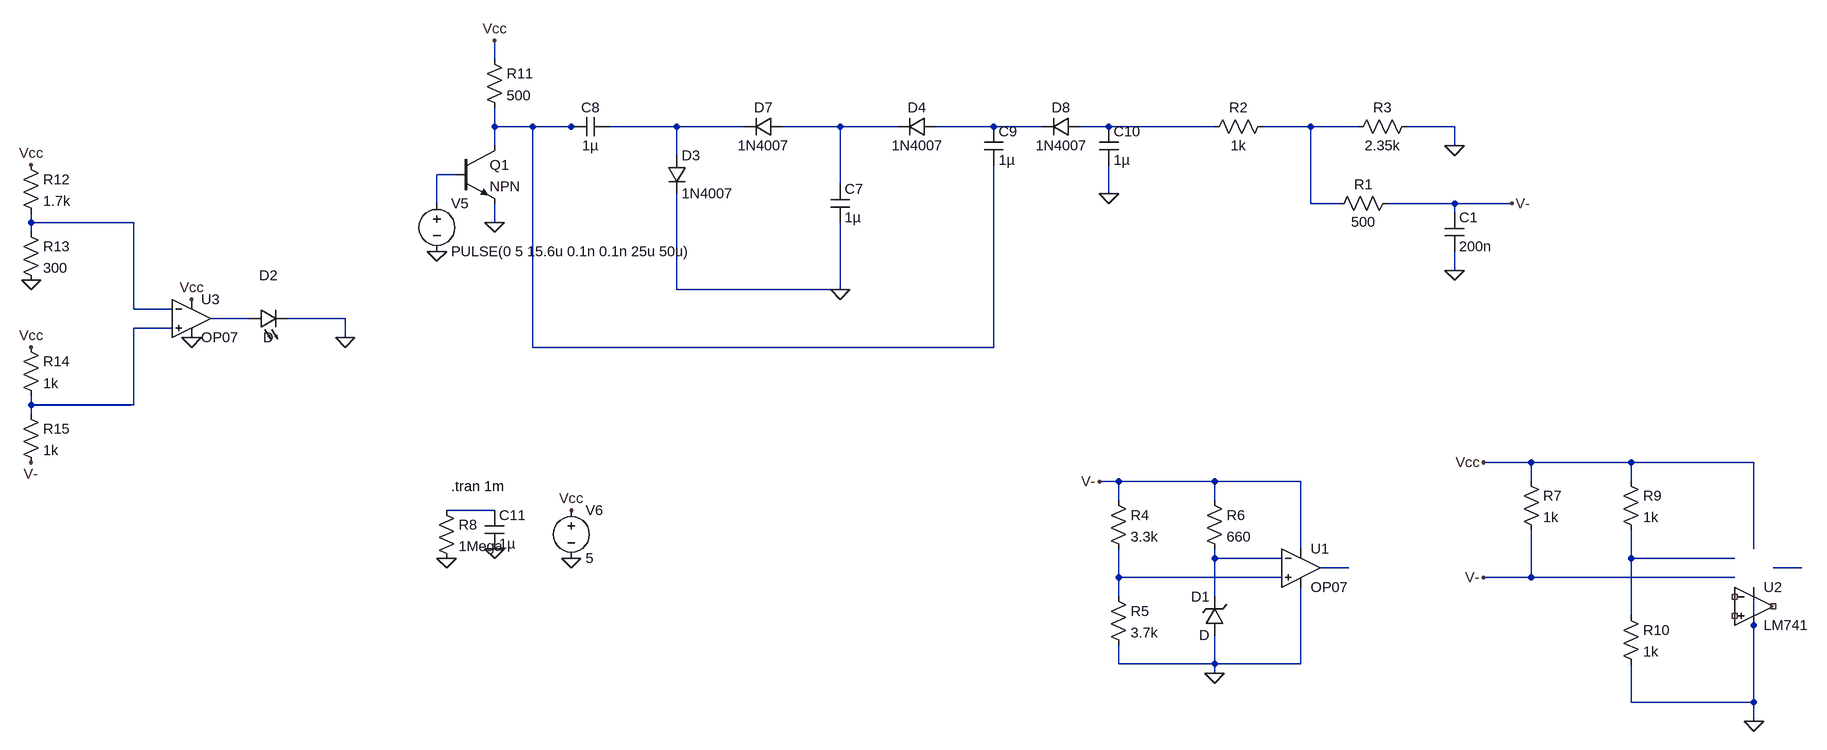
[diagram p0: schematic Lab_project.asc]
Lab_project.asc, the LTspice schematic file:
Version 4
SHEET 1 4400 1044
WIRE 2160 -80 2160 -112
WIRE 2160 32 2160 0
WIRE 2224 32 2160 32
WIRE 2288 32 2224 32
WIRE 2304 32 2288 32
WIRE 2464 32 2352 32
WIRE 2576 32 2464 32
WIRE 2736 32 2640 32
WIRE 2832 32 2736 32
WIRE 2992 32 2896 32
WIRE 3072 32 2992 32
WIRE 3184 32 3136 32
WIRE 3360 32 3184 32
WIRE 3520 32 3440 32
WIRE 3600 32 3520 32
WIRE 3760 32 3680 32
WIRE 2160 64 2160 32
WIRE 3760 64 3760 32
WIRE 2464 80 2464 32
WIRE 2096 112 2064 112
WIRE 2736 128 2736 32
WIRE 3184 144 3184 96
WIRE 2064 160 2064 112
WIRE 3520 160 3520 32
WIRE 3568 160 3520 160
WIRE 3760 160 3648 160
WIRE 3856 160 3760 160
WIRE 3760 176 3760 160
WIRE 336 192 336 176
WIRE 544 192 336 192
WIRE 2160 192 2160 160
WIRE 336 208 336 192
WIRE 3760 272 3760 240
WIRE 2464 304 2464 144
WIRE 2736 304 2736 192
WIRE 2736 304 2464 304
WIRE 544 336 544 192
WIRE 608 336 544 336
WIRE 736 352 672 352
WIRE 896 352 800 352
WIRE 608 368 544 368
WIRE 896 384 896 352
WIRE 2224 400 2224 32
WIRE 2992 400 2992 96
WIRE 2992 400 2224 400
WIRE 336 496 336 480
WIRE 544 496 544 368
WIRE 544 496 336 496
WIRE 336 512 336 496
WIRE 3888 592 3808 592
WIRE 4096 592 3888 592
WIRE 4304 592 4096 592
WIRE 3200 624 3168 624
WIRE 3360 624 3200 624
WIRE 3504 624 3360 624
WIRE 3888 624 3888 592
WIRE 4096 624 4096 592
WIRE 3200 656 3200 624
WIRE 3360 656 3360 624
WIRE 2160 672 2080 672
WIRE 3504 736 3504 624
WIRE 4304 736 4304 592
WIRE 3360 752 3360 736
WIRE 3472 752 3360 752
WIRE 4096 752 4096 704
WIRE 4272 752 4096 752
WIRE 3584 768 3536 768
WIRE 4384 768 4336 768
WIRE 3200 784 3200 736
WIRE 3472 784 3200 784
WIRE 3888 784 3888 704
WIRE 3888 784 3808 784
WIRE 4272 784 3888 784
WIRE 3200 816 3200 784
WIRE 3360 816 3360 752
WIRE 4096 848 4096 752
WIRE 3200 928 3200 896
WIRE 3360 928 3360 880
WIRE 3360 928 3200 928
WIRE 3504 928 3504 800
WIRE 3504 928 3360 928
WIRE 3360 944 3360 928
WIRE 4096 992 4096 928
WIRE 4304 992 4304 800
WIRE 4304 992 4096 992
WIRE 4304 1024 4304 992
FLAG 2064 240 0
FLAG 2736 304 0
FLAG 3184 144 0
FLAG 2160 736 0
FLAG 2080 752 0
FLAG 3760 272 0
FLAG 3760 64 0
FLAG 3856 160 V-
FLAG 3360 944 0
FLAG 3168 624 V-
FLAG 4304 1024 0
FLAG 3808 784 V-
FLAG 2288 752 0
FLAG 2288 672 Vcc
FLAG 3808 592 Vcc
FLAG 2160 192 0
FLAG 2160 -112 Vcc
FLAG 640 320 Vcc
FLAG 640 384 0
FLAG 336 288 0
FLAG 336 96 Vcc
FLAG 336 400 Vcc
FLAG 336 592 V-
FLAG 896 384 0
SYMBOL voltage 2064 144 R0
WINDOW 123 0 0 Left 0
WINDOW 39 0 0 Left 0
SYMATTR InstName V5
SYMATTR Value PULSE(0 5 15.6u 0.1n 0.1n 25u 50u)
SYMBOL cap 2720 128 R0
SYMATTR InstName C7
SYMATTR Value 1µ
SYMBOL cap 2288 48 R270
WINDOW 0 32 32 VTop 2
WINDOW 3 0 32 VBottom 2
SYMATTR InstName C8
SYMATTR Value 1µ
SYMBOL diode 2448 80 R0
SYMATTR InstName D3
SYMATTR Value 1N4007
SYMBOL diode 2640 16 R90
WINDOW 0 0 32 VBottom 2
WINDOW 3 32 32 VTop 2
SYMATTR InstName D7
SYMATTR Value 1N4007
SYMBOL diode 2896 16 R90
WINDOW 0 0 32 VBottom 2
WINDOW 3 32 32 VTop 2
SYMATTR InstName D4
SYMATTR Value 1N4007
SYMBOL cap 2976 32 R0
SYMATTR InstName C9
SYMATTR Value 1µ
SYMBOL voltage 2288 656 R0
WINDOW 123 0 0 Left 0
WINDOW 39 0 0 Left 0
SYMATTR InstName V6
SYMATTR Value 5
SYMBOL diode 3136 16 R90
WINDOW 0 0 32 VBottom 2
WINDOW 3 32 32 VTop 2
SYMATTR InstName D8
SYMATTR Value 1N4007
SYMBOL cap 3168 32 R0
SYMATTR InstName C10
SYMATTR Value 1µ
SYMBOL cap 2144 672 R0
SYMATTR InstName C11
SYMATTR Value 1µ
SYMBOL res 2064 656 R0
SYMATTR InstName R8
SYMATTR Value 1Mega
SYMBOL res 3664 144 R90
WINDOW 0 0 56 VBottom 2
WINDOW 3 32 56 VTop 2
SYMATTR InstName R1
SYMATTR Value 500
SYMBOL cap 3744 176 R0
SYMATTR InstName C1
SYMATTR Value 200n
SYMBOL res 3456 16 R90
WINDOW 0 0 56 VBottom 2
WINDOW 3 32 56 VTop 2
SYMATTR InstName R2
SYMATTR Value 1k
SYMBOL res 3696 16 R90
WINDOW 0 0 56 VBottom 2
WINDOW 3 32 56 VTop 2
SYMATTR InstName R3
SYMATTR Value 2.35k
SYMBOL res 3184 640 R0
SYMATTR InstName R4
SYMATTR Value 3.3k
SYMBOL res 3184 800 R0
SYMATTR InstName R5
SYMATTR Value 3.7k
SYMBOL res 3344 640 R0
SYMATTR InstName R6
SYMATTR Value 660
SYMBOL zener 3376 880 R180
WINDOW 0 24 64 Left 2
WINDOW 3 24 0 Left 2
SYMATTR InstName D1
SYMBOL OpAmps\\OP07 3504 704 R0
SYMATTR InstName U1
SYMBOL npn 2096 64 R0
SYMATTR InstName Q1
SYMBOL res 3872 608 R0
SYMATTR InstName R7
SYMATTR Value 1k
SYMBOL res 4080 608 R0
SYMATTR InstName R9
SYMATTR Value 1k
SYMBOL res 4080 832 R0
SYMATTR InstName R10
SYMATTR Value 1k
SYMBOL OpAmps\\LM741 4304 768 R0
SYMATTR InstName U2
SYMBOL res 2144 -96 R0
SYMATTR InstName R11
SYMATTR Value 500
SYMBOL OpAmps\\OP07 640 288 R0
SYMATTR InstName U3
SYMBOL res 320 80 R0
SYMATTR InstName R12
SYMATTR Value 1.7k
SYMBOL res 320 192 R0
SYMATTR InstName R13
SYMATTR Value 300
SYMBOL res 320 384 R0
SYMATTR InstName R14
SYMATTR Value 1k
SYMBOL res 320 496 R0
SYMATTR InstName R15
SYMATTR Value 1k
SYMBOL LED 736 368 R270
WINDOW 0 72 32 VTop 2
WINDOW 3 0 32 VBottom 2
SYMATTR InstName D2
TEXT 2088 632 Left 2 !.tran 1m

The netlist it stands for:
* Lab_project.asc
V5 N007 0 PULSE(0 5 15.6u 0.1n 0.1n 25u 50u)
C7 N003 0 1µ
C8 N001 N002 1µ
D3 N002 0 1N4007
D7 N003 N002 1N4007
D4 N004 N003 1N4007
C9 N004 N001 1µ
V6 Vcc 0 5
D8 N005 N004 1N4007
C10 N005 0 1µ
C11 N011 0 1µ
R8 N011 0 1Mega
R1 V- N006 500
C1 V- 0 200n
R2 N006 N005 1k
R3 0 N006 2.35k
R4 V- N016 3.3k
R5 N016 0 3.7k
R6 V- N012 660
D1 0 N012 D
XU1 N016 N012 V- 0 N014 LT1001  ; OP07, pins In+ In- V+ V- OUT
Q1 N001 N007 0 0 NPN
R7 Vcc V- 1k
R9 Vcc N013 1k
R10 N013 0 1k
XU2 NC_01 NC_02 0 0 NC_03 LM741  ; pins In+ In- V+ V- OUT
R11 Vcc N001 500
XU3 N010 N008 Vcc 0 N009 LT1001  ; OP07, pins In+ In- V+ V- OUT
R12 Vcc N008 1.7k
R13 N008 0 300
R14 Vcc N010 1k
R15 N010 V- 1k
D2 N009 0 D
.model D D
.lib standard.dio
.model NPN NPN
.model PNP PNP
.lib standard.bjt
.tran 1m
.lib LTC.lib
.lib LM741.lib
.backanno
.end